# EAGLE design boost-charge-activeFull (EAGLE 7.4.0)
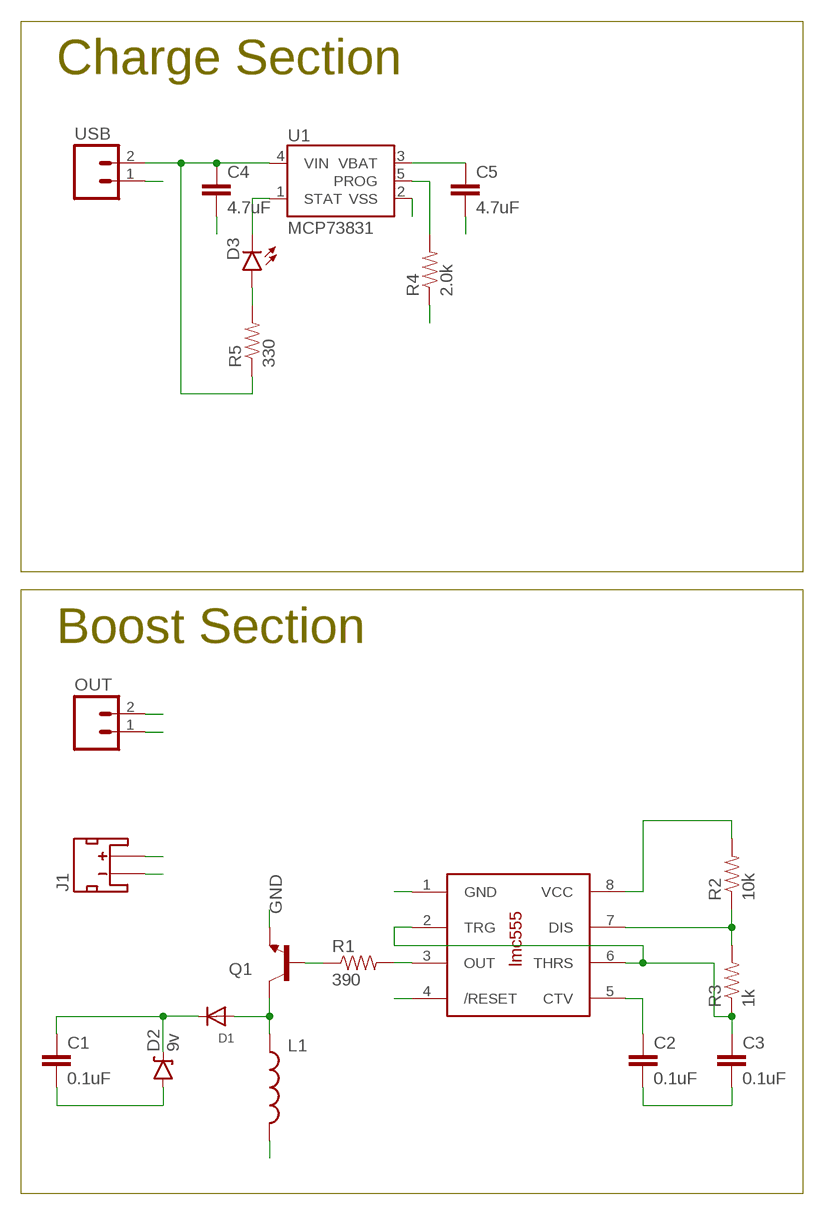
[diagram p0: schematic, sheet 1]

## Parts
C1  0.1uF  0.1UF-25V(+80/-20%)(0603)  [0603-CAP]
C2  0.1uF  0.1UF-25V(+80/-20%)(0603)  [0603-CAP]
C3  0.1uF  0.1UF-25V(+80/-20%)(0603)  [0603-CAP]
C4  4.7uF  0.1UF-25V-5%(0603)  [0603-CAP]
C5  4.7uF  0.1UF-25V-5%(0603)  [0603-CAP]
D1  DIODESOD-323F  [SOD-323F]
D2  9v  DIODE-ZENER3.3V  [SOD-323]
D3  LED0603  [LED-0603]
J1  JST_2MM_MALE  [JST-2-SMD]
L1  INDUCTOR0603  [0603]
OUT  M02PTH  [1X02]
Q1  TRANSISTOR_NPN2N3904  [TO-92]
R1  390  5.62KOHM1/10W1%(0603)  [0603-RES]
R2  10k  0OHM-1/10W-5%(0603)  [0603]
R3  1k  0OHM-1/10W-5%(0603)  [0603]
R4  2.0k  2.0KOHM1/10W5%(0603)  [0603-RES]
R5  330  330OHM1/10W1%(0603)  [0603-RES]
U1  MCP73831  [SOT23-5]
U$1  LMC555  [LMC555]
USB  M02PTH  [1X02]

## Nets
3V: C5.1 J1.2(+) L1.2 R2.2 U1.3(VBAT) U$1.4(/RESET) U$1.8(VCC)
9V: C1.1 D1.C D2.C OUT.2
GND: C1.2 C2.2 C3.2 C4.2 C5.2 D2.A J1.1(-) OUT.1 Q1.1(E) R4.1 U1.2(VSS) U$1.1(GND) USB.1
N$1: R4.2 U1.5(PROG)
N$2: D1.A L1.1 Q1.3(C)
N$3: R1.2 U$1.3(OUT)
N$4: Q1.2(B) R1.1
N$5: C3.1 R3.1 U$1.2(TRG) U$1.6(THRS)
N$7: C2.1 U$1.5(CTV)
N$8: R2.1 R3.2 U$1.7(DIS)
N$9: D3.C U1.1(STAT)
N$10: D3.A R5.2
VCC: C4.1 R5.1 U1.4(VIN) USB.2
Unconnected: J1.NC1(PAD1) J1.NC2(PAD2)

## Notes on the sheet
- Charge Section
- Boost Section

## Library data of the parts
C1-C3 = SparkFun-Capacitors:0.1UF-25V(+80/-20%)(0603): CAP-00810 Ceramic Standard decoupling cap; PROD_ID: CAP-00810
C4 C5 = SparkFun-Capacitors:0.1UF-25V-5%(0603): CAP-08604; PROD_ID: CAP-08604; VALUE: 0.1uF
D1 = adafruit:DIODE: Diode SMADIODE - SMA Surface Mount Package 20V 1A Schottky Diode Digikey: 641-1014-6-ND DO-1N4148 - Through Hole Small Current Diode SOD-123 20V 1 A (.5mV Vf) Schottky Diode - Digikey: MBRX120TPMSCT-ND SOD-323 10V 570mA (.38mV Vf, 3ns) Schottky Diode - Digikey: ZLLS410CT-ND SOD-523 30V 30mA Schottky Diode (RB751S-40TE61) - Digikey: RB751S-40TE61CT-ND SOT23-R/W - SOT23 Package (R = Solder Paste/Reflow Ovens, W = Hand-Soldering) BAT54Film 40V 300mA - Digikey: 497-7162-1-ND
D2 = SparkFun-DiscreteSemi:DIODE-ZENER: Zener Diode Production Part - 8199 3.4V Zener Voltage; PROD_ID: DIO-11284; VALUE: 3.3V
D3 = SparkFun-LED:LED: LEDs Standard schematic elements and footprints for 5mm, 3mm, 1206, and 0603 sized LEDs. 5mm - Spark Fun Electronics SKU : COM-00529 (and others)
J1 = SparkFun-Connectors:JST_2MM_MALE: Mates to single-cell LiPo batteries. CONN-11443 Now with smashable polarity marks!; BTM_NEG: -; BTM_POS: +; PROD_ID: CONN-11443; TOP_NEG: -; TOP_POS: +
L1 = SparkFun-Passives:INDUCTOR: Inductors Basic Inductor/Choke - 0603 and 1206. Footprints are not proven and vary greatly between part numbers. INDUCTOR POWER 3.3UH 4.0A SMD 0.197" L x 0.197" W x 0.177" H (5.00mm x 5.00mm x 4.50mm)
OUT USB = SparkFun-Connectors:M02: Standard 2-pin 0.1" header. Use with - straight break away headers ( PRT-00116) - right angle break away headers (PRT-00553) - swiss pins (PRT-00743) - machine pins (PRT-00117) - female headers (PRT-00115) Molex polarized connector foot print use with: PRT-08233 with associated crimp pins and housings. 2.54_SCREWTERM for use with PRT-10571. 3.5mm Screw Terminal footprints for PRT-08084 5mm Screw Terminal footprints for use with PRT-08432
Q1 = SparkFun-DiscreteSemi:TRANSISTOR_NPN: Generic NPN BJT MMBT2222A - TRANS-08049 (SOT-23, 1A 40V) MPSA42 - TRANS-09116 (SOT-23, 500mA 300V) MMBT5088LT1G - TRANS-11160 (SOT-23, 50 mA 30V) BC547 - COM-08928 <http://www.sparkfun.com/products/8928> (TO-92 45V 100mA) (1.Collector 2.Base 3.Emitter) 2N3904 - COM-00521 <http://www.sparkfun.com/products/521> (TO-92 40V 200mA) (1.Emitter 2.Base 3.Collector) P2N2222A - COM-12852 <http://www.sparkfun.com/products/12852> (TO-92 40V 600mA) (1.Collector 2.Base 3.Emitter); PROD_ID: TRANS-08447
R1 = SparkFun-Resistors:5.62KOHM1/10W1%(0603): RES-09823; PROD_ID: RES-09823; VALUE: 5.62k
R2 R3 = SparkFun-Resistors:0OHM-1/10W-5%(0603): RES-08609; PROD_ID: RES-08609; VALUE: 0
R4 = SparkFun-Resistors:2.0KOHM1/10W5%(0603): RES-08296; PROD_ID: RES-08296
R5 = SparkFun-Resistors:330OHM1/10W1%(0603): RES-00818; PROD_ID: RES-00818
U1 = SparkFun-PowerIC:MCP73831: Miniature single cell, fully integrated Li-Ion, Li-polymer charge management controller http://ww1.microchip.com/downloads/en/DeviceDoc/20001984g.pdf IC-09995; PROD_ID: IC-09995
U$1 = activelib:LMC555

## Board
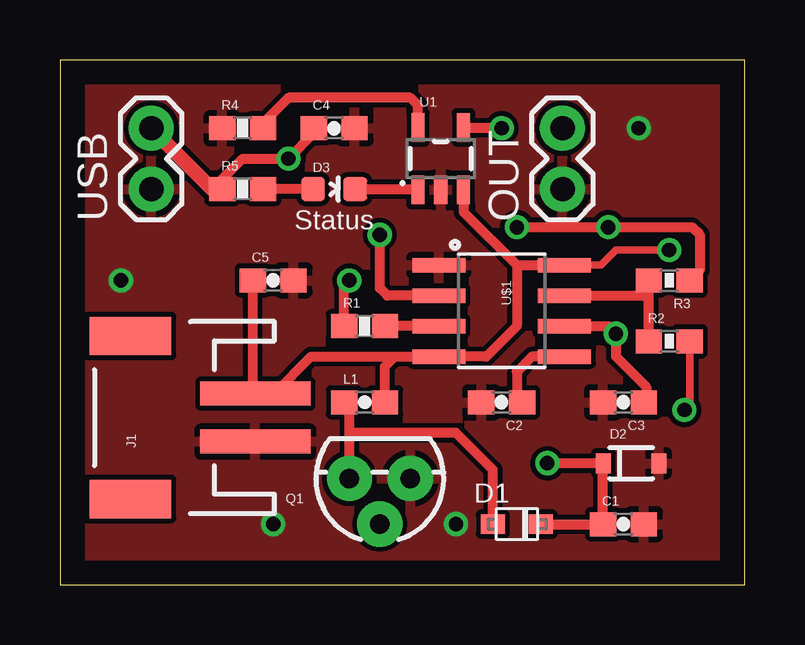
[diagram p1: board, top side]
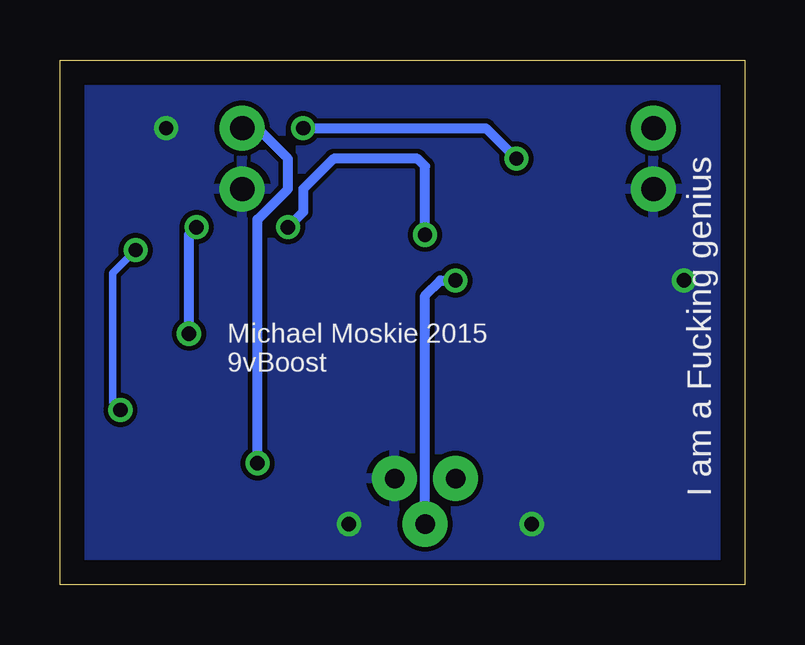
[diagram p2: board, bottom side, seen from below]

Size 28.55 x 21.89 mm. Coordinates in mm from the lower left corner, seen from the top.
Outline: 0,0 28.55,0 28.55,21.89 0,21.89 0,0
Copper layers (1*16): Top 0.035mm / dielectric 1.5mm / Bottom 0.035mm
Design rules "default": minimum track width 10mil, minimum drill 24mil, track to track 8mil, track to pad 8mil, pad to pad 8mil, via to via 8mil, smd to smd 8mil, copper to edge 40mil, drill to drill 8mil, minimum pad ring 10mil, minimum via ring 8mil, stop-mask expansion 4mil, vias tented up to drill 0mil, thermal gap 10mil

### Footprints (pad centres in the part's own frame; a part is rotated, then mirrored left to right if it is on the bottom)
0603-CAP = smd 1.1 x 1: 1 -0.85,0; 2 0.85,0
SOD-323F = smd 1 x 0.8: A -1,0; C 1,0
SOD-323 = smd 0.63 x 0.83: A 1.15,0; C -1.15,0
LED-0603 = smd 1 x 1: A 0,-0.877; C 0,0.877
JST-2-SMD = smd 1 x 4.6: 1 -1,-3.7; 2 1,-3.7 | smd 1.6 x 3.4: NC1 -3.4,1.5; NC2 3.4,1.5
0603 = smd 1.1 x 1: 1 -0.85,0; 2 0.85,0
1X02 = drill 1.016 pad 1.88: 1 0,0; 2 2.54,0
TO-92 = drill 0.813 pad 1.88: 1 -1.27,0; 2 0,1.905; 3 1.27,0
0603-RES = smd 1.1 x 1: 1 -0.85,0; 2 0.85,0
SOT23-5 = smd 0.55 x 1.2: 1 -0.95,-1.3; 2 0,-1.3; 3 0.95,-1.3; 4 0.95,1.3; 5 -0.95,1.3
LMC555 = smd 0.61 x 2.21: 1 -1.905,-2.616; 2 -0.635,-2.616; 3 0.635,-2.616; 4 1.905,-2.616; 5 1.905,2.616; 6 0.635,2.616; 7 -0.635,2.616; 8 -1.905,2.616

### Placement (x,y rotation side)
C1  23.5,2.54 0 top
C2  18.41,7.62 180 top
C3  23.5,7.62 180 top
C4  11.43,19.05 0 top
C5  8.89,12.7 0 top
D1  19.05,2.54 0 top
D2  23.81,5.08 0 top
D3  11.43,16.51 270 top
J1  4.45,6.99 90 top
L1  12.7,7.62 0 top
OUT  20.95,16.51 90 top
Q1  13.34,4.45 180 top
R1  12.7,10.79 0 top
R2  25.4,10.16 0 top
R3  25.4,12.7 180 top
R4  7.62,19.05 0 top
R5  7.62,16.51 0 top
U1  15.88,17.78 0 top
U$1  18.41,11.43 270 top
USB  3.81,16.51 90 top

### Tracks (layer width: path | path; a pad name or v marks a point on that pad's centre or on a via)
3V  (via drill 0.6)
  Top 0.305: R2.2 26.25,7.52 v26.04,7.3 | U$1.8 22.54,13.34 23.18,13.97 v25.4,13.97
  Top 0.406: U1.3 16.82,15.56 19.05,13.34 | 19.05,13.34 U$1.8 | C5.1 8.04,8.09 J1.2 | L1.2 13.55,9.11 13.97,9.53 | 13.97,9.53 U$1.4 17.78,9.53 19.05,10.79 19.05,13.34 | 8.94,7.99 10.48,9.53 13.97,9.53
  Top 0.61: J1.2 8.94,7.99
  Bottom 0.305: v26.04,7.3 26.35,7.62 26.35,13.02 v25.4,13.97
9V  (via drill 0.6)
  Top 0.406: D1.C C1.1 22.64,5.06 D2.C v20.32,5.08
  Bottom 0.406: v20.32,5.08 20.32,15.24 19.05,16.51 19.05,17.78 20.32,19.05 OUT.2
GND  (via drill 0.6)
  other vias: 24.13,19.05 2.54,12.7 16.51,2.54 8.89,2.54
  pour Top: -1.27,22.86 -1.27,-1.27 29.21,-1.27 29.21,22.86
  pour Bottom: -1.27,22.86 -1.27,-1.27 29.21,-1.27 29.21,22.86
N$1
  Top 0.406: R4.2 8.47,19.27 9.53,20.32 14.61,20.32 14.93,20 U1.5
N$2
  Top 0.406: Q1.3 12.06,6.35 | 12.06,6.35 12.06,7.41 L1.1 | D1.A 18.05,4.81 16.51,6.35 12.06,6.35
N$3
  Top 0.406: U$1.3 R1.2
N$4  (via drill 0.6)
  Top 0.406: R1.1 11.85,12.48 v12.06,12.7
  Bottom 0.406: Q1.2 13.34,12.06 12.7,12.7 v12.06,12.7
N$5  (via drill 0.6)
  Top 0.406: U$1.2 13.65,12.06 13.34,12.38 v13.34,14.61 | v19.05,14.92 v22.86,14.92 26.35,14.92 26.67,14.61 26.67,13.12 R3.1 | U$1.6 22.86,10.79 v23.18,10.48 23.18,9.53 24.45,8.26 24.45,7.72 C3.1
  Bottom 0.406: v13.34,14.61 13.34,17.46 13.65,17.78 17.14,17.78 18.41,16.51 18.41,15.56 v19.05,14.92 | v23.18,10.48 23.18,14.61 v22.86,14.92
N$7
  Top 0.406: U$1.5 19.68,9.53 19.05,8.89 19.05,7.83 C2.1
N$8
  Top 0.406: R2.1 24.55,12.06 | 24.55,12.06 R3.2 | U$1.7 24.55,12.06
N$9
  Top 0.406: D3.C 14.89,16.51 U1.1
N$10
  Top 0.406: D3.A R5.2
VCC  (via drill 0.6)
  Top 0.406: U1.4 18.39,19.08 v18.41,19.05 | R5.1 6.77,16.93 7.62,17.78 v9.53,17.78 10.58,18.84 C4.1
  Top 0.61: R5.1 6.35,16.51 USB.2
  Bottom 0.406: v18.41,19.05 10.79,19.05 v9.53,17.78

### Text on the board
tPlace: Status
bPlace: I am a Fucking genius | Michael Moskie 2015 / 9vBoost